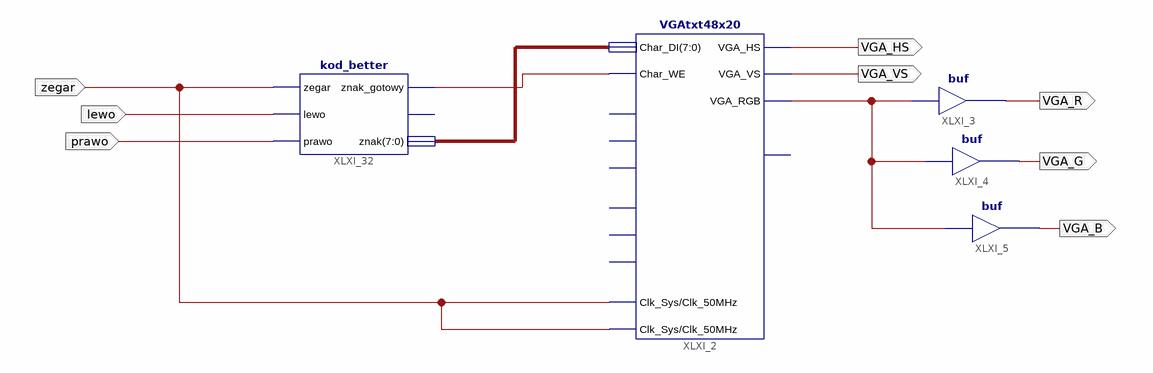
[diagram p0: schematic sheet 1]
// Xilinx ISE schematic schemat.sch (spartan3e) as structural Verilog: 5 symbols, 8 ports
module schemat (
  input  zegar,
  input  lewo,
  input  prawo,
  output VGA_HS,
  output VGA_VS,
  output VGA_R,
  output VGA_G,
  output VGA_B
);

  wire XLXN_4, XLXN_5;
  wire [7:0] XLXN_7;

  VGAtxt48x20 XLXI_2 (
    .Char_DI(XLXN_7), .Clk_Sys(zegar), .Clk_50MHz(zegar), .VGA_HS(VGA_HS), .VGA_VS(VGA_VS), .VGA_RGB(XLXN_4),
    .Char_WE(XLXN_5));  // open: Home, NewLine, Goto00, CursorOn, ScrollEn, ScrollClear, Busy
  buf XLXI_3 (VGA_R, XLXN_4);
  buf XLXI_4 (VGA_G, XLXN_4);
  buf XLXI_5 (VGA_B, XLXN_4);
  kod_better XLXI_32 (
    .zegar(zegar), .lewo(lewo), .prawo(prawo), .znak_gotowy(XLXN_5), .znak(XLXN_7));  // open: go_to_beginning
endmodule
